# EAGLE design OSC1 (EAGLE 7.7.0)
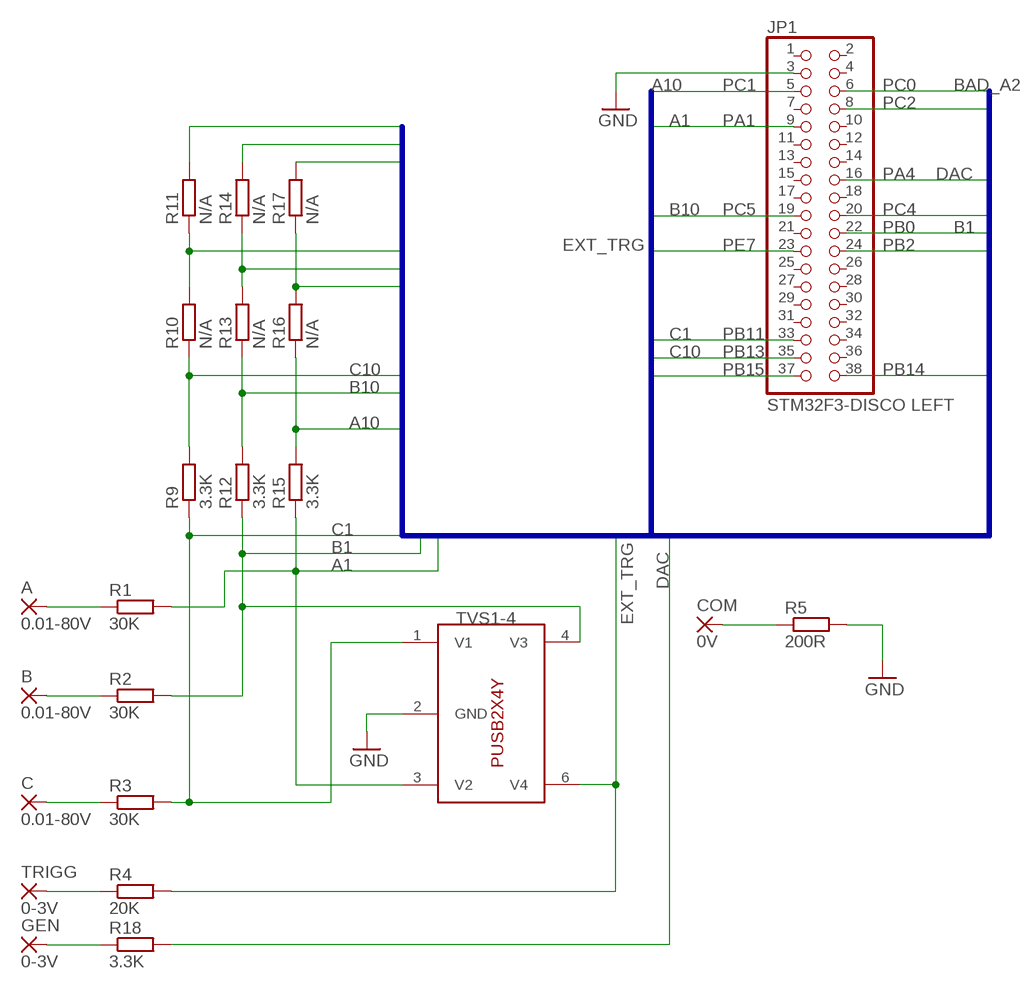
[diagram p0: schematic, sheet 1]

## Parts
A  0.01-80V  2,54/0,8  [2,54/0,8]
B  0.01-80V  2,54/0,8  [2,54/0,8]
C  0.01-80V  2,54/0,8  [2,54/0,8]
COM  0V  2,54/0,8  [2,54/0,8]
GEN  0-3V  2,54/0,8  [2,54/0,8]
JP1  STM32F3-DISCO LEFT  PINHD-2X19  [2X19]
R1  30K  R-EU_R1206  [R1206]
R2  30K  R-EU_R1206  [R1206]
R3  30K  R-EU_R1206  [R1206]
R4  20K  R-EU_R1206  [R1206]
R5  200R  R-EU_R1206  [R1206]
R9  3.3K  R-EU_R1206  [R1206]
R10  N/A  R-EU_R1206  [R1206]
R11  N/A  R-EU_R1206  [R1206]
R12  3.3K  R-EU_R1206  [R1206]
R13  N/A  R-EU_R1206  [R1206]
R14  N/A  R-EU_R1206  [R1206]
R15  3.3K  R-EU_R1206  [R1206]
R16  N/A  R-EU_R1206  [R1206]
R17  N/A  R-EU_R1206  [R1206]
R18  3.3K  R-EU_R1206  [R1206]
TRIGG  0-3V  2,54/0,8  [2,54/0,8]
TVS1-4  PUSB2X4Y  [SOT363_PHILIPS]

## Nets
A1: JP1.9 R1.2 R15.1 TVS1-4.3(V2)
A10: JP1.5 R15.2 R16.1
B1: JP1.22 R2.2 R12.1 TVS1-4.4(V3)
B10: JP1.19 R12.2 R13.1
BAD_A2: JP1.6 R17.2
BAD_A10: JP1.8 R16.2 R17.1
BAD_B2: JP1.24 R14.2
BAD_B10: JP1.20 R13.2 R14.1
BAD_C2: JP1.38 R11.2
BAD_C10: JP1.37 R10.2 R11.1
C1: JP1.33 R3.2 R9.1 TVS1-4.1(V1)
C10: JP1.35 R9.2 R10.1
DAC: JP1.16 R18.2
EXT_TRG: JP1.23 R4.2 TVS1-4.6(V4)
GND: JP1.3 R5.2 TVS1-4.2(GND)
N$1: COM.1(P) R5.1
N$3: A.1(P) R1.1
N$5: R4.1 TRIGG.1(P)
N$7: C.1(P) R3.1
N$9: B.1(P) R2.1
N$19: GEN.1(P) R18.1
Unconnected: JP1.1 JP1.2 JP1.4 JP1.7 JP1.10 JP1.11 JP1.12 JP1.13 JP1.14 JP1.15 JP1.17 JP1.18 JP1.21 JP1.25 JP1.26 JP1.27 JP1.28 JP1.29 JP1.30 JP1.31 JP1.32 JP1.34 JP1.36

## Buses
A1,A2,A10,A30,B1,B2,B10,B30,C1,C2,C10,C30,EXT_TRG,DAC

## Notes on the sheet
- PC1 | PC0
- PC2
- PA1
- PA4
- PC5 | PC4
- PB0
- PE7 | PB2
- PB11
- PB13
- PB15 | PB14

## Library data of the parts
A B C COM GEN TRIGG = wirepad:2,54/0,8: THROUGH-HOLE PAD
JP1 = pinhead:PINHD-2X19: PIN HEADER
R1-R5 R9-R18 = rcl:R-EU_: RESISTOR, European symbol
TVS1-4 = oscill:PUSB2X4Y: PUSB2X4Y ESD protection for high-speed interfaces clamping 3.8V 4 inputs

## Board
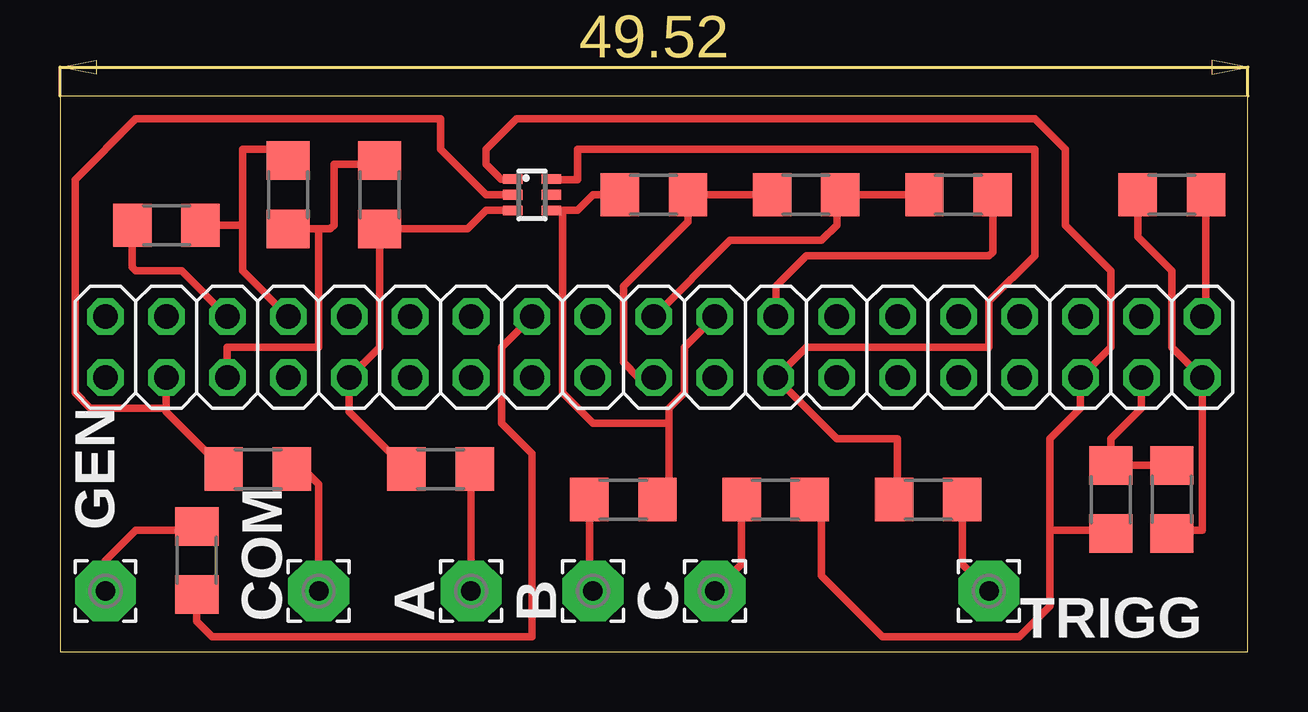
[diagram p1: board, top side]

Size 49.52 x 23.16 mm. Coordinates in mm from the lower left corner, seen from the top.
Outline: 49.52,0 49.52,23.16 0,23.16 0,0 49.52,0
Copper layers (1*16): Top 0.0356mm / dielectric 1.5011mm / Bottom 0.0356mm
Design rules "LaenPCBOrder(oshpark) *": minimum track width 6mil, minimum drill 13mil, track to track 6mil, track to pad 6mil, pad to pad 6mil, via to via 6mil, smd to smd 6mil, copper to edge 15mil, drill to drill 6mil, minimum pad ring 7mil, minimum via ring 7mil, stop-mask expansion 3mil, vias tented up to drill 0mil, thermal gap 10mil

### Footprints (pad centres in the part's own frame; a part is rotated, then mirrored left to right if it is on the bottom)
2,54/0,8 = drill 0.813 pad 2.54 octagon: 1 0,0
2X19 = drill 1.016 octagon: 1 -22.86,-1.27; 2 -22.86,1.27; 3 -20.32,-1.27; 4 -20.32,1.27; 5 -17.78,-1.27; 6 -17.78,1.27; 7 -15.24,-1.27; 8 -15.24,1.27; 9 -12.7,-1.27; 10 -12.7,1.27; 11 -10.16,-1.27; 12 -10.16,1.27; 13 -7.62,-1.27; 14 -7.62,1.27; 15 -5.08,-1.27; 16 -5.08,1.27; 17 -2.54,-1.27; 18 -2.54,1.27; 19 0,-1.27; 20 0,1.27; 21 2.54,-1.27; 22 2.54,1.27; 23 5.08,-1.27; 24 5.08,1.27; 25 7.62,-1.27; 26 7.62,1.27; 27 10.16,-1.27; 28 10.16,1.27; 29 12.7,-1.27; 30 12.7,1.27; 31 15.24,-1.27; 32 15.24,1.27; 33 17.78,-1.27; 34 17.78,1.27; 35 20.32,-1.27; 36 20.32,1.27; 37 22.86,-1.27; 38 22.86,1.27
R1206 = smd 1.6 x 1.803: 1 -1.422,0; 2 1.422,0
SOT363_PHILIPS = smd 0.4 x 0.8: 1 -0.65,-0.8; 2 0,-0.8; 3 0.65,-0.8; 4 0.65,0.8; 5 0,0.8; 6 -0.65,0.8

### Placement (x,y rotation side)
A  17.13,2.54 90 top
B  22.21,2.54 90 top
C  27.29,2.54 90 top
COM  10.79,2.54 90 top
GEN  1.9,2.54 90 top
JP1  24.75,12.7 0 top
R1  15.87,7.62 180 top
R2  23.48,6.35 0 top
R3  29.83,6.35 0 top
R4  36.19,6.35 180 top
R5  8.25,7.62 180 top
R9  43.8,6.35 90 top
R10  46.34,6.35 270 top
R11  46.34,19.05 0 top
R12  24.75,19.05 0 top
R13  31.1,19.05 0 top
R14  37.46,19.05 0 top
R15  13.33,19.05 90 top
R16  9.52,19.05 90 top
R17  4.44,17.78 180 top
R18  5.71,3.81 270 top
TRIGG  38.73,2.54 90 top
TVS1-4  19.67,19.05 270 top

### Tracks (layer width: path | path; a pad name or v marks a point on that pad's centre or on a via)
A1
  Top 0.305: R1.2 12.05,10.01 JP1.9 13.33,12.7 R15.1 16.98,17.63 17.77,18.41 TVS1-4.3
A10
  Top 0.305: JP1.5 6.98,12.7 10.79,12.7 10.79,17.63 | R15.2 13.17,20.32 11.42,20.32 11.42,17.78 11.27,17.63 10.79,17.63 | 10.79,17.63 R16.1
B1
  Top 0.305: 25.39,9.53 22.21,9.53 20.94,10.79 20.94,18.41 21.58,18.41 | R2.2 25.39,6.83 25.39,9.53 | TVS1-4.4 21.56,18.4 21.58,18.41 | R12.1 22.21,19.05 21.58,18.41 | 25.39,9.53 25.39,10.16 26.02,10.79 26.02,12.7 JP1.22
B10
  Top 0.305: R13.1 R12.2 26.18,17.93 23.48,15.24 23.48,12.06 24.12,11.43 JP1.19
BAD_A2
  Top 0.305: JP1.6 5.07,15.88 3.17,15.88 3.01,16.03 R17.2
BAD_A10
  Top 0.305: JP1.8 7.61,15.88 7.61,17.78 | 7.61,17.78 R17.1 | R16.2 9.03,20.95 7.61,20.95 7.61,17.78
BAD_B2
  Top 0.305: JP1.24 29.83,15.24 31.1,16.51 38.73,16.51 38.88,16.66 R14.2
BAD_B10
  Top 0.305: R14.1 R13.2 32.38,18.9 32.38,17.78 31.74,17.14 27.93,17.14 JP1.20
BAD_C2
  Top 0.305: JP1.38 47.77,14.12 R11.2
BAD_C10
  Top 0.305: R10.2 46.5,5.08 47.62,5.08 JP1.37 46.34,12.7 46.34,15.88 44.92,17.3 R11.1
C1
  Top 0.305: R9.1 43.8,5.08 41.27,5.08 | 41.27,5.08 41.27,8.89 42.54,10.16 JP1.33 43.8,12.7 43.8,15.88 41.9,17.78 41.9,20.95 40.63,22.22 19.04,22.22 17.77,20.95 17.77,20.32 18.39,19.7 TVS1-4.1 | 41.27,5.08 41.27,1.91 40,0.64 34.28,0.64 31.74,3.17 31.74,5.87 R3.2
C10
  Top 0.305: R10.1 R9.2 43.8,8.89 45.08,10.16 JP1.35
DAC
  Top 0.305: R18.2 5.71,1.27 6.34,0.64 19.67,0.64 19.67,8.26 18.4,9.53 18.4,12.7 JP1.16
EXT_TRG
  Top 0.305: R4.2 34.91,6.5 34.91,8.89 32.38,8.89 JP1.23 31.1,12.7 38.73,12.7 38.73,14.61 40.63,16.51 40.63,20.95 21.58,20.95 21.58,19.68 20.49,19.68 TVS1-4.6
GND
  Top 0.305: R5.2 4.44,10.01 4.44,10.16 | 4.44,10.16 JP1.3 | 4.44,10.16 1.26,10.16 0.62,10.79 0.62,19.68 3.17,22.22 15.87,22.22 15.87,20.95 17.77,19.05 TVS1-4.2
N$1
  Top 0.305: COM.1 10.79,6.99 10.15,7.62 R5.1
N$3
  Top 0.305: R1.1 17.13,7.47 A.1
N$5
  Top 0.305: TRIGG.1 37.61,3.66 R4.1
N$7
  Top 0.305: C.1 28.41,3.66 R3.1
N$9
  Top 0.305: B.1 22.06,2.69 R2.1
N$19
  Top 0.305: R18.1 5.55,5.08 3.17,5.08 1.9,3.81 GEN.1

### Text on the board
tValues: TOP-> / LFT->
bValues: TOP LEFT-> | STM32F3-DISCOVERY / OSCILLOSCOPE | https://goo.gl/CjWM7u | TOP LEFT->